# Altium schematic sheet PWM_BoardSchem.SchDoc
size A; SheetNumber: 2; SheetTotal: 6
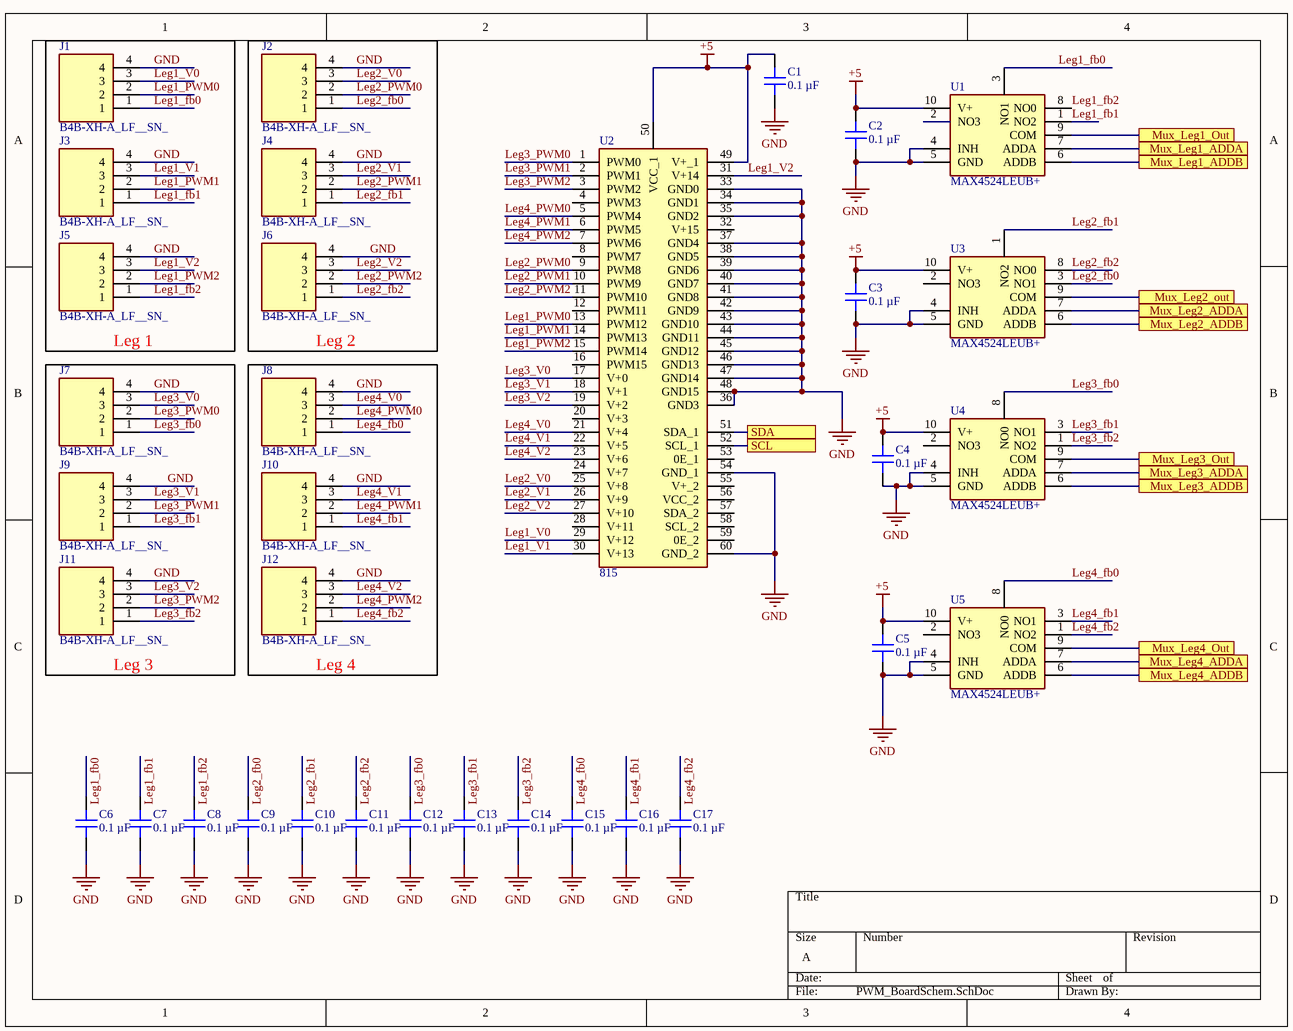
[diagram p0: PWM_BoardSchem.SchDoc]

## Parts
C1  0.1 µF  [CAP 1210_3225 - 1MM]
C2  0.1 µF  [CAP 1210_3225 - 1MM]
C3  0.1 µF  [CAP 1210_3225 - 1MM]
C4  0.1 µF  [CAP 1210_3225 - 1MM]
C5  0.1 µF  [CAP 1210_3225 - 1MM]
C6  0.1 µF  [CAP 1210_3225 - 1MM]
C7  0.1 µF  [CAP 1210_3225 - 1MM]
C8  0.1 µF  [CAP 1210_3225 - 1MM]
C9  0.1 µF  [CAP 1210_3225 - 1MM]
C10  0.1 µF  [CAP 1210_3225 - 1MM]
C11  0.1 µF  [CAP 1210_3225 - 1MM]
C12  0.1 µF  [CAP 1210_3225 - 1MM]
C13  0.1 µF  [CAP 1210_3225 - 1MM]
C14  0.1 µF  [CAP 1210_3225 - 1MM]
C15  0.1 µF  [CAP 1210_3225 - 1MM]
C16  0.1 µF  [CAP 1210_3225 - 1MM]
C17  0.1 µF  [CAP 1210_3225 - 1MM]
J1  B4B-XH-A_LF__SN_  [B4BXHALFSN]
J2  B4B-XH-A_LF__SN_  [B4BXHALFSN]
J3  B4B-XH-A_LF__SN_  [B4BXHALFSN]
J4  B4B-XH-A_LF__SN_  [B4BXHALFSN]
J5  B4B-XH-A_LF__SN_  [B4BXHALFSN]
J6  B4B-XH-A_LF__SN_  [B4BXHALFSN]
J7  B4B-XH-A_LF__SN_  [B4BXHALFSN]
J8  B4B-XH-A_LF__SN_  [B4BXHALFSN]
J9  B4B-XH-A_LF__SN_  [B4BXHALFSN]
J10  B4B-XH-A_LF__SN_  [B4BXHALFSN]
J11  B4B-XH-A_LF__SN_  [B4BXHALFSN]
J12  B4B-XH-A_LF__SN_  [B4BXHALFSN]
U1  MAX4524LEUB+  [SOP50P490X110-10N]
U2  815  [815]
U3  MAX4524LEUB+  [SOP50P490X110-10N]
U4  MAX4524LEUB+  [SOP50P490X110-10N]
U5  MAX4524LEUB+  [SOP50P490X110-10N]

## Blocks framed on the sheet
Leg 1: J1 J3 J5
Leg 2: J2 J4 J6
Leg 3: J7 J9 J11
Leg 4: J8 J10 J12

## Ports
Mux_Leg1_ADDA, Mux_Leg1_ADDB, Mux_Leg1_Out, Mux_Leg2_ADDA, Mux_Leg2_ADDB, Mux_Leg2_out, Mux_Leg3_ADDA, Mux_Leg3_ADDB, Mux_Leg3_Out, Mux_Leg4_ADDA, Mux_Leg4_ADDB, Mux_Leg4_Out, SCL, SDA

## Nets
+5: C1.2 C2.2 C3.2 C4.2 C5.2 U1.10(V+) U2.49(V+_1) U2.50(VCC_1) U3.10(V+) U4.10(V+) U5.10(V+)
GND: C1.1 C2.1 C3.1 C4.1 C5.1 C6.1 C7.1 C8.1 C9.1 C10.1 C11.1 C12.1 C13.1 C14.1 C15.1 C16.1 C17.1 J1.4 J2.4 J3.4 J4.4 J5.4 J6.4 J7.4 J8.4 J9.4 J10.4 J11.4 J12.4 U1.4(INH) U1.5(GND) U2.33(GND0) U2.34(GND1) U2.35(GND2) U2.36(GND3) U2.37(GND4) U2.38(GND5) U2.39(GND6) U2.40(GND7) U2.41(GND8) U2.42(GND9) U2.43(GND10) U2.44(GND11) U2.45(GND12) U2.46(GND13) U2.47(GND14) U2.48(GND15) U2.54(GND_1) U2.60(GND_2) U3.4(INH) U3.5(GND) U4.4(INH) U4.5(GND) U5.4(INH) U5.5(GND)
Leg1_fb0: C6.2 J1.1 U1.3(NO1)
Leg1_fb1: C7.2 J3.1 U1.1(NO2)
Leg1_fb2: C8.2 J5.1 U1.8(NO0)
Leg1_PWM0: J1.2 U2.13(PWM12)
Leg1_PWM1: J3.2 U2.14(PWM13)
Leg1_PWM2: J5.2 U2.15(PWM14)
Leg1_V0: J1.3 U2.29(V+12)
Leg1_V1: J3.3 U2.30(V+13)
Leg1_V2: J5.3 U2.31(V+14)
Leg2_fb0: C9.2 J2.1 U3.3(NO1)
Leg2_fb1: C10.2 J4.1 U3.1(NO2)
Leg2_fb2: C11.2 J6.1 U3.8(NO0)
Leg2_PWM0: J2.2 U2.9(PWM8)
Leg2_PWM1: J4.2 U2.10(PWM9)
Leg2_PWM2: J6.2 U2.11(PWM10)
Leg2_V0: J2.3 U2.25(V+8)
Leg2_V1: J4.3 U2.26(V+9)
Leg2_V2: J6.3 U2.27(V+10)
Leg3_fb0: C12.2 J7.1 U4.8(NO0)
Leg3_fb1: C13.2 J9.1 U4.3(NO1)
Leg3_fb2: C14.2 J11.1 U4.1(NO2)
Leg3_PWM0: J7.2 U2.1(PWM0)
Leg3_PWM1: J9.2 U2.2(PWM1)
Leg3_PWM2: J11.2 U2.3(PWM2)
Leg3_V0: J7.3 U2.17(V+0)
Leg3_V1: J9.3 U2.18(V+1)
Leg3_V2: J11.3 U2.19(V+2)
Leg4_fb0: C15.2 J8.1 U5.8(NO0)
Leg4_fb1: C16.2 J10.1 U5.3(NO1)
Leg4_fb2: C17.2 J12.1 U5.1(NO2)
Leg4_PWM0: J8.2 U2.5(PWM4)
Leg4_PWM1: J10.2 U2.6(PWM5)
Leg4_PWM2: J12.2 U2.7(PWM6)
Leg4_V0: J8.3 U2.21(V+4)
Leg4_V1: J10.3 U2.22(V+5)
Leg4_V2: J12.3 U2.23(V+6)
Mux_Leg1_ADDA: U1.7(ADDA) ; port Mux_Leg1_ADDA
Mux_Leg1_ADDB: U1.6(ADDB) ; port Mux_Leg1_ADDB
Mux_Leg1_Out: U1.9(COM) ; port Mux_Leg1_Out
Mux_Leg2_ADDA: U3.7(ADDA) ; port Mux_Leg2_ADDA
Mux_Leg2_ADDB: U3.6(ADDB) ; port Mux_Leg2_ADDB
Mux_Leg2_out: U3.9(COM) ; port Mux_Leg2_out
Mux_Leg3_ADDA: U4.7(ADDA) ; port Mux_Leg3_ADDA
Mux_Leg3_ADDB: U4.6(ADDB) ; port Mux_Leg3_ADDB
Mux_Leg3_Out: U4.9(COM) ; port Mux_Leg3_Out
Mux_Leg4_ADDA: U5.7(ADDA) ; port Mux_Leg4_ADDA
Mux_Leg4_ADDB: U5.6(ADDB) ; port Mux_Leg4_ADDB
Mux_Leg4_Out: U5.9(COM) ; port Mux_Leg4_Out
SCL: U2.52(SCL_1) ; port SCL
SDA: U2.51(SDA_1) ; port SDA

Not connected (* = marked no-connect by the designer): U1 2(NO3); U2 4(PWM3) 8(PWM7) 12(PWM11) 16(PWM15) 20(V+3) 24(V+7) 28(V+11) 32(V+15) 53(0E_1) 55(V+_2) 56(VCC_2) 57(SDA_2) 58(SCL_2) 59(0E_2); U3 2(NO3); U4 2(NO3); U5 2(NO3)

## Library data of the parts
C1-C17 = C1210C104J5GACAUTO: CAP CER 0.1UF 50V C0G/NP0 1210; manufacturer: KEMET; Temperature Coefficient: C0G, NP0; Tolerance: ±5%; Part Number: C1210C104J5GACAUTO; Value: 0.1 µF; Applications: Automotive; Capacitance: 0.1 µF; componentlink1description: Datasheet; componentlink1url: https://api.kemet.com/component-edge/download/datasheet/C1210C104J5GACAUTO.pdf; componentlink2description: DigiKey Link; componentlink2url: https://www.digikey.com/en/products/detail/kemet/C1210C104J5GACAUTO/7516038; Device Package: 1210 (3225 Metric); Features: Low ESL; lastupdated: 9/19/2022 1:23:33 PM; Lifecycle Status: Active; Minimum Order: 1; Mounting Type: Surface Mount, MLCC; Operating Temperature: -55°C ~ 125°C; Package / Case: 1210 (3225 Metric); packaging: TapeAndReel; partid: 43680; Part Status: Active; price: 0.54; Ratings: AEC-Q200; series: SMD Auto C0G; Size / Dimension: 0.126" L x 0.098" W (3.20mm x 2.50mm); Supplier 1: DigiKey; Supplier Part Number 1: 399-15804-1-ND; Thickness (Max): 0.055" (1.40mm); Voltage - Rated: 50V
J1-J12 = B4B-XH-A_LF__SN_: Connector; Manufacturer_Name: JST (JAPAN SOLDERLESS TERMINALS); Manufacturer_Part_Number: B4B-XH-A(LF)(SN); Datasheet Link: https://datasheet.lcsc.com/szlcsc/JST-Sales-America-B4B-XH-A-LF-SN_C144395.pdf; Height: 7mm; Arrow Part Number: B4B-XH-A(LF)(SN); Arrow Price/Stock: https://www.arrow.com/en/products/b4b-xh-a-lf-sn/jst-manufacturing
U1 U3-U5 = MAX4524LEUB+: Integrated Circuit; Manufacturer_Name: Maxim Integrated; Datasheet Link: https://datasheets.maximintegrated.com/en/ds/MAX4524L-MAX4525L.pdf; Height: 1.1mm; Manufacturer_Part_Number: MAX4524LEUB+; Mouser Part Number: 700-MAX4524LEUB+; Mouser Price/Stock: https://www.mouser.co.uk/ProductDetail/Maxim-Integrated/MAX4524LEUB%2b?qs=Mc2rGIXtnyWlO7eYhLJKZQ%3D%3D
U2 = 815: Undefined or Miscellaneous; Manufacturer_Name: Adafruit; Datasheet Link: https://cdn-shop.adafruit.com/datasheets/PCA9685.pdf; Manufacturer_Part_Number: 815; Mouser Part Number: 485-815; Mouser Price/Stock: https://www.mouser.co.uk/ProductDetail/Adafruit/815?qs=GURawfaeGuCGKbWyy9179Q%3D%3D; Arrow Part Number: 815; Arrow Price/Stock: https://www.arrow.com/en/products/815/adafruit-industries